# EAGLE design MOS stage (EAGLE 9.2.2)
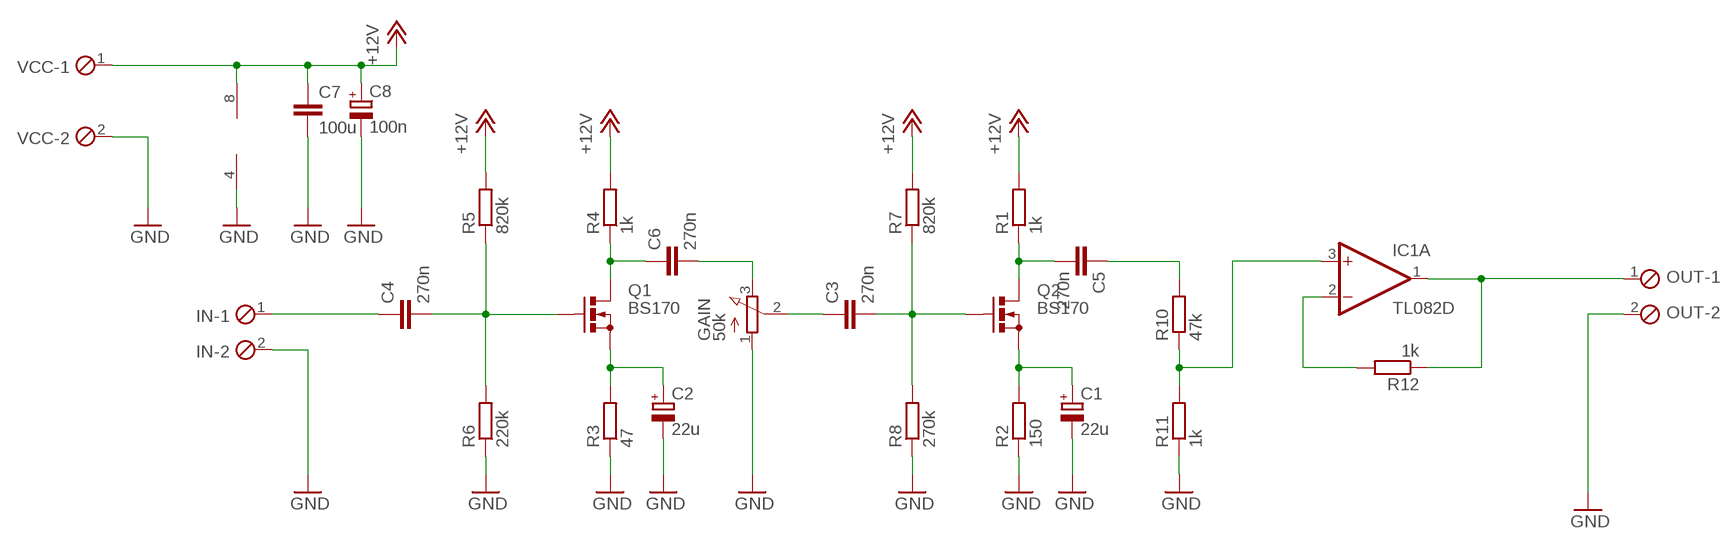
[diagram p0: schematic, sheet 1]

## Parts
C1  22u  CPOL-EUE2.5-5  [E2,5-5]
C2  22u  CPOL-EUE2.5-5  [E2,5-5]
C3  270n  C-EUC1206  [C1206]
C4  270n  C-EUC1206  [C1206]
C5  270n  C-EUC1206  [C1206]
C6  270n  C-EUC1206  [C1206]
C7  100u  C-EUC1206  [C1206]
C8  100n  CPOL-EUE2.5-5  [E2,5-5]
GAIN  50k  3RP/1610N  [3RP/1610N]
IC1  TL082D  [SO08]
IN  MPT2  [2POL254]
OUT  MPT2  [2POL254]
Q1  BS170  [SOT54E]
Q2  BS170  [SOT54E]
R1  1k  R-EU_R0805  [R0805]
R2  150  R-EU_R0805  [R0805]
R3  47  R-EU_R0805  [R0805]
R4  1k  R-EU_R0805  [R0805]
R5  820k  R-EU_R0805  [R0805]
R6  220k  R-EU_R0805  [R0805]
R7  820k  R-EU_R0805  [R0805]
R8  270k  R-EU_R0805  [R0805]
R10  47k  R-EU_R0805  [R0805]
R11  1k  R-EU_R0805  [R0805]
R12  1k  R-EU_R0805  [R0805]
VCC  MPT2  [2POL254]

## Nets
+12V: C7.1 C8.+ IC1.8(P:V+) R1.2 R4.2 R5.2 R7.2 VCC.1
GND: C1.- C2.- C7.2 C8.- GAIN.1(A) IC1.4(P:V-) IN.2 OUT.2 R2.1 R3.1 R6.1 R8.1 R11.1 VCC.2
N$1: C5.2 Q2.D R1.1
N$2: C3.2 Q2.G R7.1 R8.2
N$3: C1.+ Q2.S R2.2
N$4: C6.1 Q1.D R4.1
N$5: C2.+ Q1.S R3.2
N$6: C4.2 Q1.G R5.1 R6.2
N$7: C4.1 IN.1
N$8: C5.1 R10.2
N$9: C6.2 GAIN.3(E)
N$10: C3.1 GAIN.2(S)
N$11: IC1.3(A:+IN) R10.1 R11.2
N$12: IC1.1(A:OUT) OUT.1 R12.1
N$13: IC1.2(A:-IN) R12.2
Unconnected: IC1.5(B:+IN) IC1.6(B:-IN) IC1.7(B:OUT)

## Library data of the parts
C1 C2 C8 = rcl:CPOL-EU: POLARIZED CAPACITOR, European symbol; SPICEPREFIX: C
C3-C7 = rcl:C-EU: CAPACITOR, European symbol; SPICEPREFIX: C
GAIN = pot:3RP/1610N: 16mm Potentiometer one level Source: http://www.alphapotentiometers.net/html/16mm_pot_2.html
IC1 = linear:TL082: OP AMP Data sheet <http://www.ti.com/lit/ds/symlink/tl084a . pdf>; DATA_SHEET: <a href="http://www.ti.com/lit/ds/symlink/tl084a.pdf"> Data sheet </a>
IN OUT VCC = con-phoenix-254:MPT2: PHOENIX CONNECTOR; OC_FARNELL: unknown; OC_NEWARK: unknown
Q1 Q2 = transistor-small-signal:BS170: N-CHANNEL MOS FET
R1-R8 R10-R12 = rcl:R-EU_: RESISTOR, European symbol; SPICEPREFIX: R

## Board
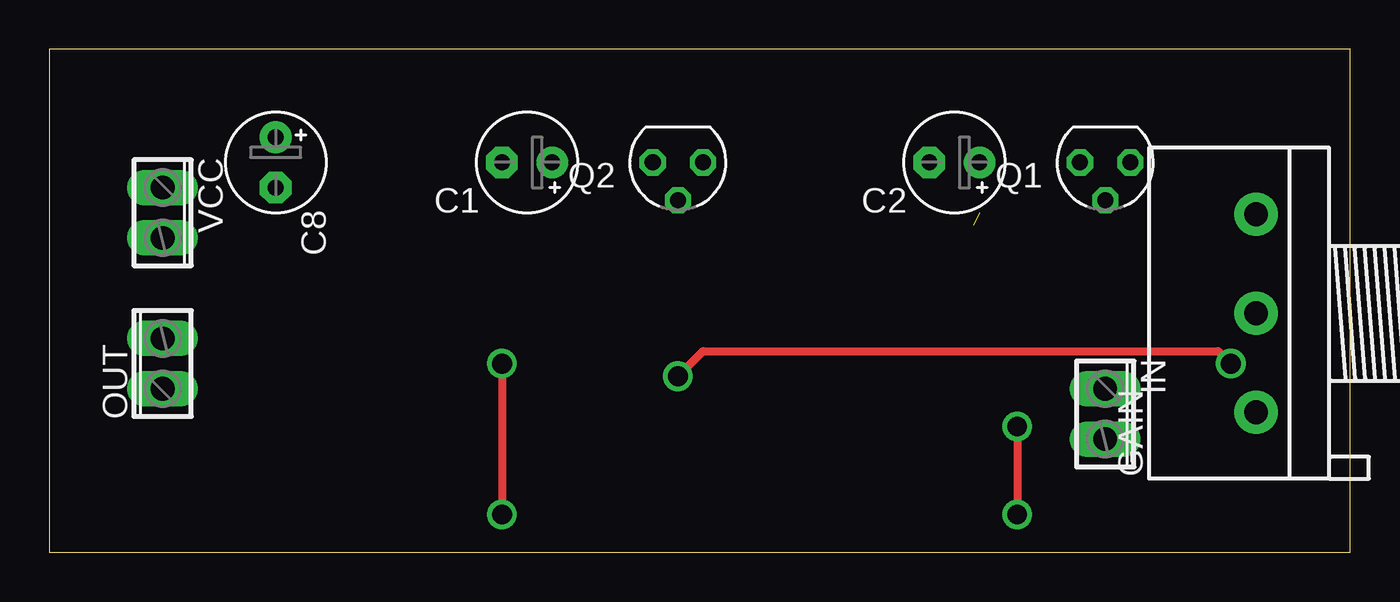
[diagram p1: board, top side]
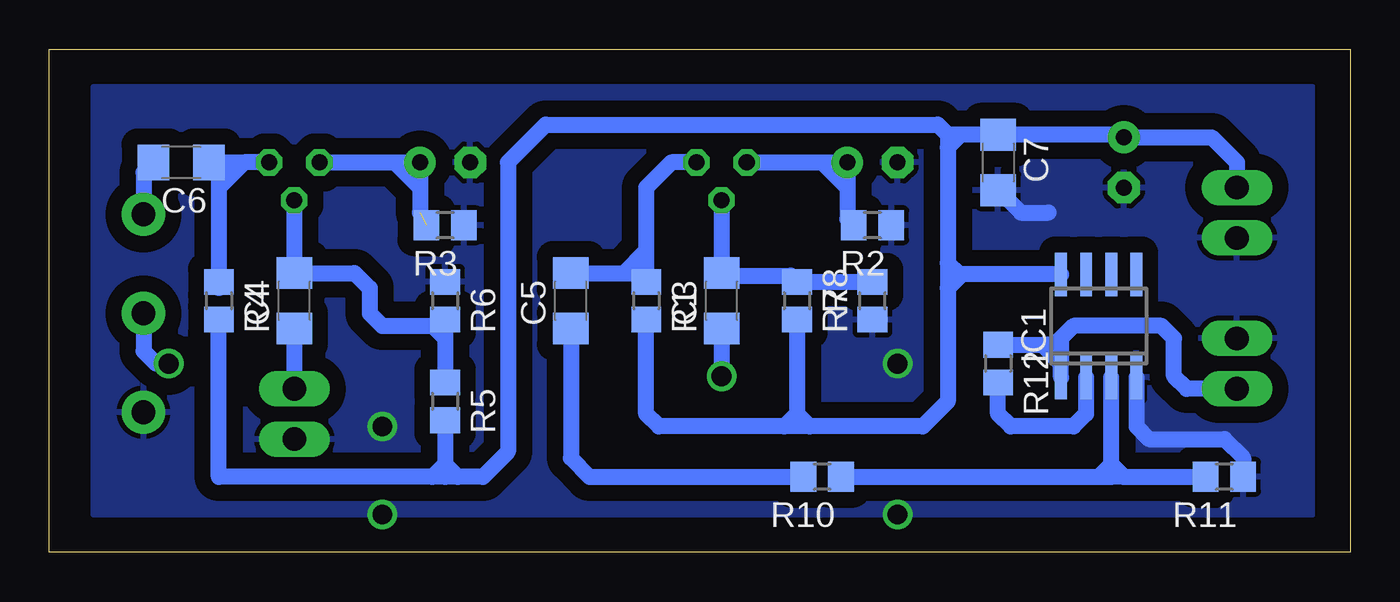
[diagram p2: board, bottom side, seen from below]

Size 65.71 x 25.39 mm. Coordinates in mm from the lower left corner, seen from the top.
Outline: 0,0 65.71,0 65.71,25.39 0,25.39 0,0
Copper layers (1*16): Top 0.035mm / dielectric 1.5mm / Bottom 0.035mm
Design rules "default": minimum track width 6mil, minimum drill 0.35mm, track to track 6mil, track to pad 6mil, pad to pad 6mil, via to via 6mil, smd to smd 6mil, copper to edge 40mil, drill to drill 6mil, minimum pad ring 10mil, minimum via ring 8mil, stop-mask expansion 4mil, vias tented up to drill 0mil, thermal gap 10mil

### Footprints (pad centres in the part's own frame; a part is rotated, then mirrored left to right if it is on the bottom)
E2,5-5 = drill 0.813 pad 1.6: + -1.27,0 | drill 0.813 pad 1.6 octagon: - 1.27,0
C1206 = smd 1.6 x 1.8: 1 -1.4,0; 2 1.4,0
3RP/1610N = drill 1.2 pad 2.184: 1 -5,0; 2 0,0; 3 5,0
SO08 = smd 0.6 x 2.2: 1 -1.905,-2.6; 2 -0.635,-2.6; 3 0.635,-2.6; 4 1.905,-2.6; 5 1.905,2.6; 6 0.635,2.6; 7 -0.635,2.6; 8 -1.905,2.6
2POL254 = drill 1.2 long: 1 -1.27,0; 2 1.27,0
SOT54E = drill 0.813 octagon: D -1.27,0; G 0,1.905; S 1.27,0
R0805 = smd 1.3 x 1.5: 1 -0.95,0; 2 0.95,0

### Placement (x,y rotation side)
C1  24.13,19.69 180 top
C2  45.72,19.69 180 top
C3  31.75,12.7 90 bottom
C4  53.34,12.7 90 bottom
C5  39.37,12.7 90 bottom
C6  59.05,19.69 180 bottom
C7  17.78,19.69 270 bottom
C8  11.43,19.69 270 top
GAIN  60.96,12.07 90 top
IC1  12.7,11.43 0 bottom
IN  53.34,6.98 270 top
OUT  5.71,9.52 90 top
Q1  53.34,19.69 180 top
Q2  31.75,19.69 180 top
R1  35.56,12.7 270 bottom
R2  24.13,16.51 180 bottom
R3  45.72,16.51 180 bottom
R4  57.15,12.7 270 bottom
R5  45.72,7.62 270 bottom
R6  45.72,12.7 270 bottom
R7  27.94,12.7 270 bottom
R8  24.13,12.7 90 bottom
R10  26.67,3.81 180 bottom
R11  6.35,3.81 180 bottom
R12  17.78,9.52 270 bottom
VCC  5.71,17.15 270 top

### Tracks (layer width: path | path; a pad name or v marks a point on that pad's centre or on a via)
+12V
  Bottom 0.813: VCC.1 5.71,19.69 6.98,20.96 C8.+ 11.56,21.09 C7.1 19.69,21.09 | 20.32,21.09 20.32,20.45 | 20.32,20.45 20.32,14.61 | 20.32,14.61 20.32,13.34 | 20.32,13.34 20.32,7.62 21.59,6.35 27.3,6.35 | 20.32,21.09 20.83,21.59 40.64,21.59 42.54,19.69 42.54,5.08 43.82,3.81 45.09,3.81 | 19.69,21.09 20.32,21.09 | 19.69,21.09 20.32,20.45 | IC1.8 19.75,14.03 | 19.75,14.03 20.32,14.61 | 19.75,14.03 19.75,13.91 20.32,13.34 | 27.3,6.35 28.58,6.35 | 28.58,6.35 34.93,6.35 35.56,6.98 R1.2 | 45.09,3.81 45.72,3.81 | 45.72,3.81 46.35,3.81 | 46.35,3.81 57.15,3.81 R4.2 | 27.94,6.98 27.3,6.35 | R7.2 27.94,6.98 | 27.94,6.98 28.58,6.35 | R5.2 45.72,4.45 | 45.72,4.45 45.72,3.81 | 45.72,4.45 45.09,3.81 | 45.72,4.45 46.35,3.81
GND  (via drill 1 pad 1.2)
  Top 0.406: v22.86,9.52 v22.86,1.91 | v48.9,6.35 v48.9,1.91
  Bottom 0.813: C7.2 16.64,17.15 15.24,17.15 | IC1.4 10.8,6.35 10.16,5.72 6.35,5.72 5.4,4.77 R11.1
  pour Bottom (isolate 0.813): 63.5,23.5 63.5,1.91 1.91,1.91 1.91,23.5
N$1
  Bottom 0.813: Q2.D 34.29,19.69 35.56,18.41 35.56,15.24 | 35.56,15.24 R1.1 36.01,14.1 36.7,14.1 | C5.2 36.7,14.1 | 36.7,14.1 35.56,15.24
N$2
  Bottom 0.813: Q2.G C3.2 31.62,13.97 28.26,13.97 R7.1 R8.2
N$3
  Bottom 0.813: Q2.S 26.67,19.69 | 26.67,19.69 C1.+ 25.4,18.41 | 26.67,19.69 25.4,18.41 | 25.4,18.41 25.4,16.83 R2.2
N$4
  Bottom 0.813: Q1.D 55.88,19.69 | 55.88,19.69 57.15,18.41 | 57.15,18.41 R4.1 57.15,13.34 | 55.88,19.69 C6.1 57.15,19.18 57.15,18.41
N$5  (1 unrouted)
  Bottom 0.813: Q1.S 48.26,19.69 | 48.26,19.69 C2.+ 46.99,18.41 | 48.26,19.69 46.99,18.41 | 46.99,18.41 46.99,17.15
N$6
  Bottom 0.813: Q1.G C4.2 | C4.2 53.21,13.97 | 45.72,10.8 R6.2 46.04,11.43 46.35,11.43 | 45.72,10.8 R5.1 | C4.2 50.29,14.1 49.53,13.34 49.53,12.07 48.9,11.43 46.99,11.43 46.35,11.43 | 46.35,11.43 45.72,10.8
N$7
  Bottom 0.813: C4.1 IN.1
N$8
  Bottom 0.813: C5.1 39.37,4.77 38.41,3.81 R10.2
N$9
  Bottom 0.813: C6.2 60.96,19.18 GAIN.3
N$10  (via drill 1 pad 1.2)
  Top 0.406: v31.75,8.89 33.02,10.16 59.05,10.16 v59.69,9.52
  Bottom 0.813: C3.1 v31.75,8.89 | GAIN.2 60.96,10.16 60.32,9.52 v59.69,9.52
N$11
  Bottom 0.813: R10.1 12.7,3.81 | 12.7,3.81 12.07,3.81 | 12.07,3.81 12.07,4.45 | 12.07,4.45 IC1.3 | 11.43,3.81 12.07,3.81 | 12.07,4.45 11.43,3.81 | 12.07,4.45 12.7,3.81 | 11.43,3.81 R11.2
N$12
  Bottom 0.813: IC1.1 14.61,9.52 | R12.1 15.55,10.48 | 15.55,10.48 14.61,9.52 | OUT.1 8.26,8.26 8.89,8.89 8.89,10.8 9.52,11.43 13.97,11.43 14.61,10.8 | 14.61,10.8 14.61,9.52 | 14.61,10.8 14.93,10.48 15.55,10.48
N$13
  Bottom 0.813: IC1.2 13.34,6.98 13.97,6.35 17.15,6.35 17.78,6.98 R12.2